# EAGLE design L3mk5ExRam (EAGLE 9.6.2)
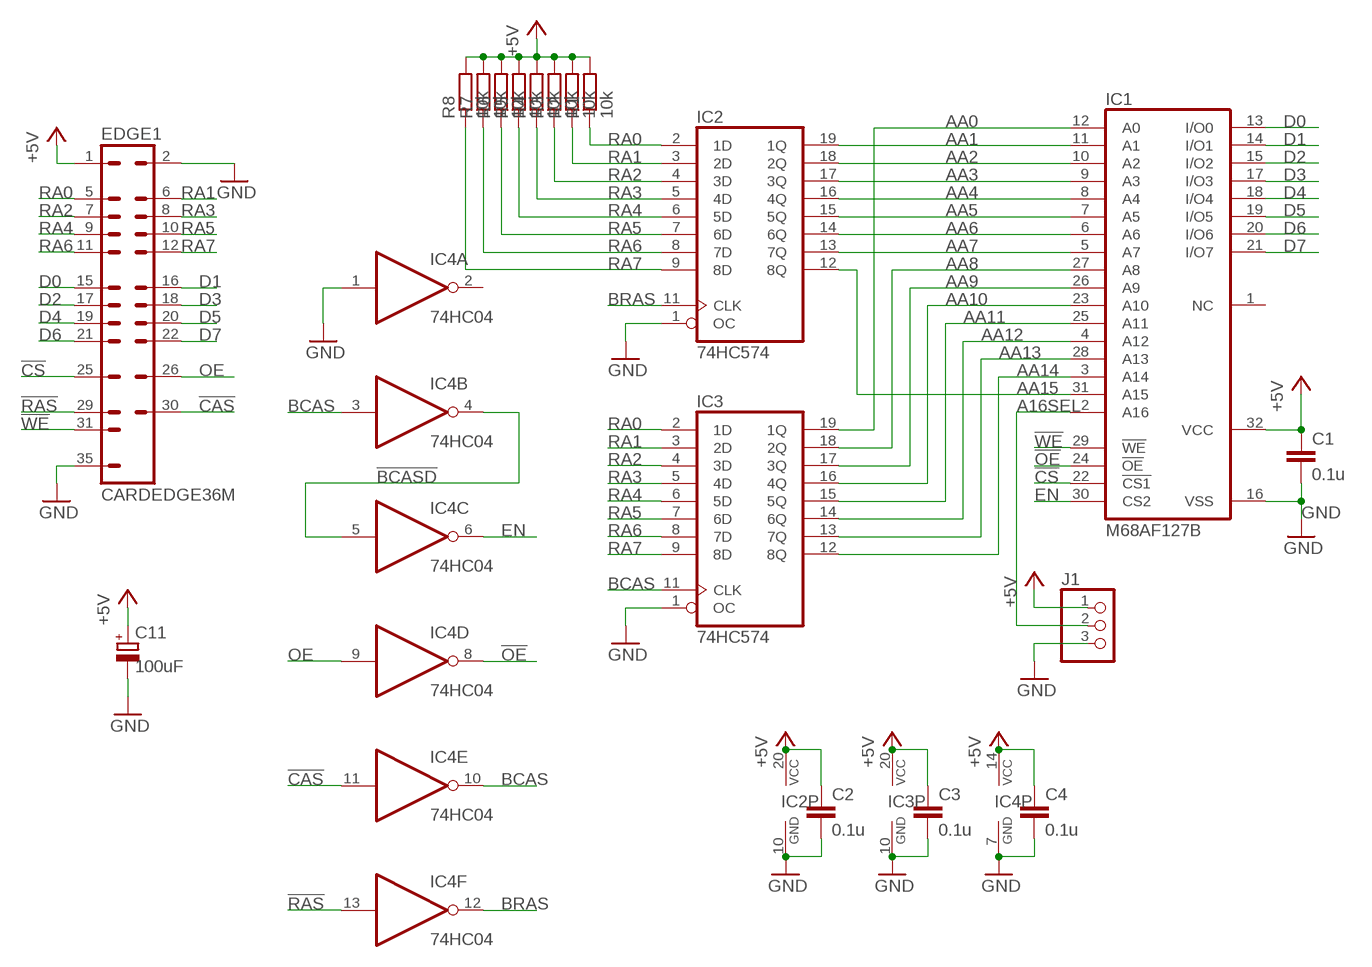
[diagram p0: schematic, sheet 1]

## Parts
C1  0.1u  C-EU025-024X044  [C025-024X044]
C2  0.1u  C-EU025-024X044  [C025-024X044]
C3  0.1u  C-EU025-024X044  [C025-024X044]
C4  0.1u  C-EU025-024X044  [C025-024X044]
C11  100uF  CPOL-EUE2-5  [E2-5]
EDGE1  CARDEDGE36M  [PM]
IC1  M68AF127B  [SOJ32-400]
IC2  74HC574  74HC574N  [DIL20]
IC3  74HC574  74HC574N  [DIL20]
IC4  74HC04  74HC04N  [DIL14]
J1  PINHD-1X3  [1X03]
R1  10k  R-EU_0204/2V  [0204V]
R2  10k  R-EU_0204/2V  [0204V]
R3  10k  R-EU_0204/2V  [0204V]
R4  10k  R-EU_0204/2V  [0204V]
R5  10k  R-EU_0204/2V  [0204V]
R6  10k  R-EU_0204/2V  [0204V]
R7  10k  R-EU_0204/2V  [0204V]
R8  10k  R-EU_0204/2V  [0204V]

## Nets
!BCASD: IC4.4(B:O) IC4.5(C:I)
!CAS: EDGE1.30 IC4.11(E:I)
!CS: EDGE1.25 IC1.22(!CS1)
!OE: IC1.24(!OE) IC4.8(D:O)
!RAS: EDGE1.29 IC4.13(F:I)
!WE: EDGE1.31 IC1.29(!WE)
+5V [Power]: C1.1 C2.1 C3.1 C4.1 C11.+ EDGE1.1 IC1.32(VCC) IC2.20(VCC) IC3.20(VCC) IC4.14(P:VCC) J1.1 R1.2 R2.2 R3.2 R4.2 R5.2 R6.2 R7.2 R8.2
A16SEL: IC1.2(A16) J1.2
AA0: IC1.12(A0) IC3.19(1Q)
AA1: IC1.11(A1) IC2.19(1Q)
AA2: IC1.10(A2) IC2.18(2Q)
AA3: IC1.9(A3) IC2.17(3Q)
AA4: IC1.8(A4) IC2.16(4Q)
AA5: IC1.7(A5) IC2.15(5Q)
AA6: IC1.6(A6) IC2.14(6Q)
AA7: IC1.5(A7) IC2.13(7Q)
AA8: IC1.27(A8) IC3.18(2Q)
AA9: IC1.26(A9) IC3.17(3Q)
AA10: IC1.23(A10) IC3.16(4Q)
AA11: IC1.25(A11) IC3.15(5Q)
AA12: IC1.4(A12) IC3.14(6Q)
AA13: IC1.28(A13) IC3.13(7Q)
AA14: IC1.3(A14) IC3.12(8Q)
AA15: IC1.31(A15) IC2.12(8Q)
BCAS: IC3.11(CLK) IC4.3(B:I) IC4.10(E:O)
BRAS: IC2.11(CLK) IC4.12(F:O)
D0: EDGE1.15 IC1.13(I/O0)
D1: EDGE1.16 IC1.14(I/O1)
D2: EDGE1.17 IC1.15(I/O2)
D3: EDGE1.18 IC1.17(I/O3)
D4: EDGE1.19 IC1.18(I/O4)
D5: EDGE1.20 IC1.19(I/O5)
D6: EDGE1.21 IC1.20(I/O6)
D7: EDGE1.22 IC1.21(I/O7)
EN: IC1.30(CS2) IC4.6(C:O)
GND [Power]: C1.2 C2.2 C3.2 C4.2 C11.- EDGE1.2 EDGE1.35 IC1.16(VSS) IC2.1(OC) IC2.10(GND) IC3.1(OC) IC3.10(GND) IC4.1(A:I) IC4.7(P:GND) J1.3
OE: EDGE1.26 IC4.9(D:I)
RA0 [Address]: EDGE1.5 IC2.2(1D) IC3.2(1D) R1.1
RA1 [Address]: EDGE1.6 IC2.3(2D) IC3.3(2D) R2.1
RA2 [Address]: EDGE1.7 IC2.4(3D) IC3.4(3D) R3.1
RA3 [Address]: EDGE1.8 IC2.5(4D) IC3.5(4D) R4.1
RA4 [Address]: EDGE1.9 IC2.6(5D) IC3.6(5D) R5.1
RA5 [Address]: EDGE1.10 IC2.7(6D) IC3.7(6D) R6.1
RA6 [Address]: EDGE1.11 IC2.8(7D) IC3.8(7D) R7.1
RA7 [Address]: EDGE1.12 IC2.9(8D) IC3.9(8D) R8.1
Unconnected: IC1.1(NC) IC4.2(A:O)

## Library data of the parts
C1-C4 = rcl:C-EU: CAPACITOR, European symbol; SPICEPREFIX: C
C11 = rcl:CPOL-EU: POLARIZED CAPACITOR, European symbol; SPICEPREFIX: C
EDGE1 = sasaji_parts:CARDEDGE36M
IC1 = sasaji_parts:M68AF127B
IC2 IC3 = 74xx-eu:74*574: 8-bit D type FLIP FLOP bus driver
IC4 = 74xx-eu:74*04: Hex INVERTER
J1 = pinhead:PINHD-1X3: PIN HEADER
R1-R8 = rcl:R-EU_: RESISTOR, European symbol; SPICEPREFIX: R

## Net classes
2 Power: width 0.508 mm

## Board
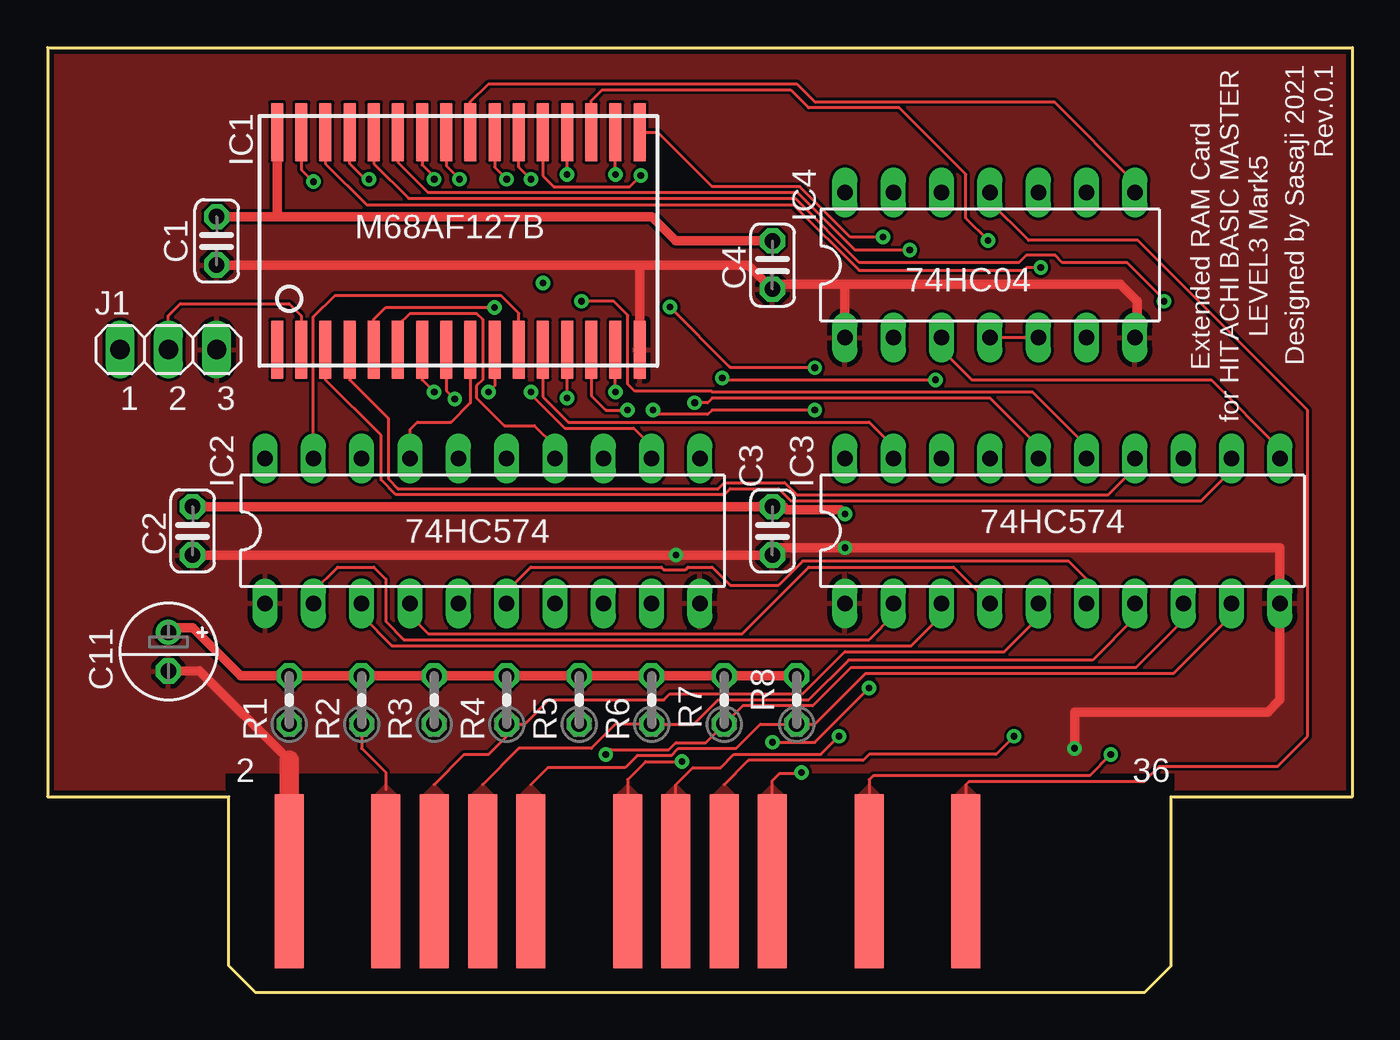
[diagram p1: board, top side]
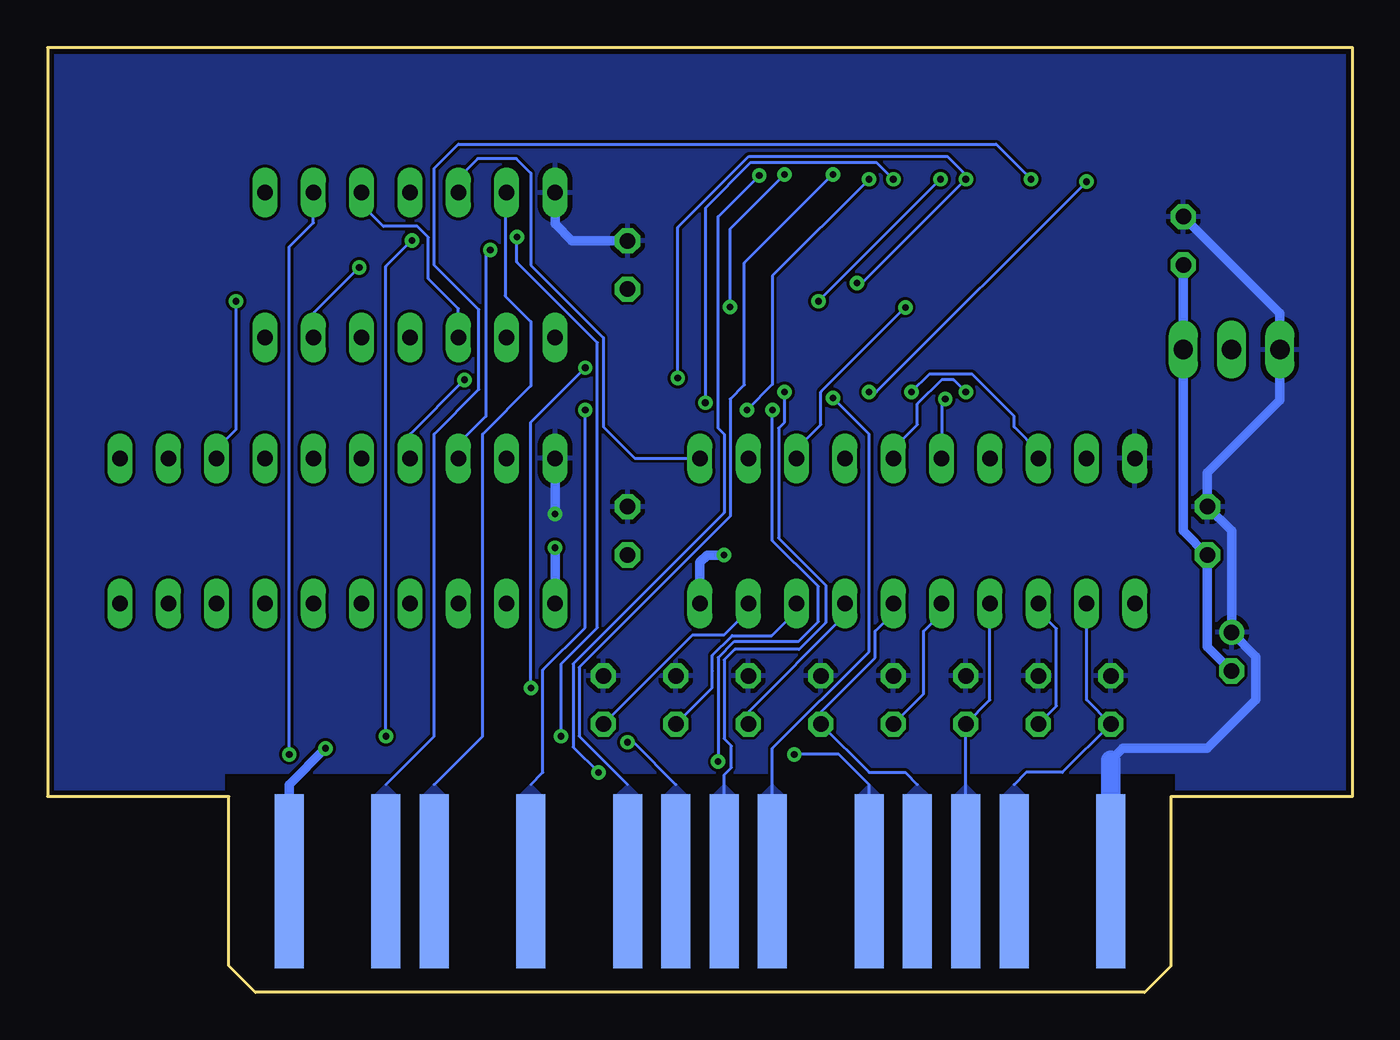
[diagram p2: board, bottom side, seen from below]

Size 68.58 x 49.66 mm. Coordinates in mm from the lower left corner, seen from the top.
Outline: 0,10.29 9.53,10.29 9.53,1.4 10.92,0 57.66,0 59.05,1.4 59.05,10.29 68.58,10.29 68.58,49.66 0,49.66 0,10.29
Copper layers (1*16): Top 0.035mm / dielectric 1.5mm / Bottom 0.035mm
Design rules "default *": minimum track width 6mil, minimum drill 0.35mm, track to track 6mil, track to pad 6mil, pad to pad 6mil, via to via 6mil, smd to smd 6mil, copper to edge 10mil, drill to drill 6mil, minimum pad ring 10mil, minimum via ring 8mil, stop-mask expansion 4mil, vias tented up to drill 0mil, thermal gap 10mil
vRestrict: area 8.9,-1.1 to 59.7,10.3

### Footprints (pad centres in the part's own frame; a part is rotated, then mirrored left to right if it is on the bottom)
C025-024X044 = drill 0.813 octagon: 1 -1.27,0; 2 1.27,0
E2-5 = drill 0.813 pad 1.27: + -1.016,0 | drill 0.813 pad 1.27 octagon: - 1.016,0
PM = smd 1.524 x 9.144 bottom: 1 -22.86,0; 5 -17.78,0; 7 -15.24,0; 9 -12.7,0; 11 -10.16,0; 15 -5.08,0; 17 -2.54,0; 19 0,0; 21 2.54,0; 25 7.62,0; 29 12.7,0; 31 15.24,0; 35 20.32,0 | smd 1.524 x 9.144: 2 -22.86,0; 6 -17.78,0; 8 -15.24,0; 10 -12.7,0; 12 -10.16,0; 16 -5.08,0; 18 -2.54,0; 20 0,0; 22 2.54,0; 26 7.62,0; 30 12.7,0
SOJ32-400 = smd 0.635 x 3.048: 1 -9.525,-5.715; 2 -8.255,-5.715; 3 -6.985,-5.715; 4 -5.715,-5.715; 5 -4.445,-5.715; 6 -3.175,-5.715; 7 -1.905,-5.715; 8 -0.635,-5.715; 9 0.635,-5.715; 10 1.905,-5.715; 11 3.175,-5.715; 12 4.445,-5.715; 13 5.715,-5.715; 14 6.985,-5.715; 15 8.255,-5.715; 16 9.525,-5.715; 17 9.525,5.715; 18 8.255,5.715; 19 6.985,5.715; 20 5.715,5.715; 21 4.445,5.715; 22 3.175,5.715; 23 1.905,5.715; 24 0.635,5.715; 25 -0.635,5.715; 26 -1.905,5.715; 27 -3.175,5.715; 28 -4.445,5.715; 29 -5.715,5.715; 30 -6.985,5.715; 31 -8.255,5.715; 32 -9.525,5.715
DIL20 = drill 0.813 long: 1 -11.43,-3.81; 2 -8.89,-3.81; 3 -6.35,-3.81; 4 -3.81,-3.81; 5 -1.27,-3.81; 6 1.27,-3.81; 7 3.81,-3.81; 8 6.35,-3.81; 9 8.89,-3.81; 10 11.43,-3.81; 11 11.43,3.81; 12 8.89,3.81; 13 6.35,3.81; 14 3.81,3.81; 15 1.27,3.81; 16 -1.27,3.81; 17 -3.81,3.81; 18 -6.35,3.81; 19 -8.89,3.81; 20 -11.43,3.81
DIL14 = drill 0.813 long: 1 -7.62,-3.81; 2 -5.08,-3.81; 3 -2.54,-3.81; 4 0,-3.81; 5 2.54,-3.81; 6 5.08,-3.81; 7 7.62,-3.81; 8 7.62,3.81; 9 5.08,3.81; 10 2.54,3.81; 11 0,3.81; 12 -2.54,3.81; 13 -5.08,3.81; 14 -7.62,3.81
1X03 = drill 1.016 long: 1 -2.54,0; 2 0,0; 3 2.54,0
0204V = drill 0.813 octagon: 1 -1.27,0; 2 1.27,0

### Placement (x,y rotation side)
C1  8.89,39.5 270 top
C2  7.62,24.26 270 top
C3  38.1,24.26 270 top
C4  38.1,38.23 270 top
C11  6.35,17.91 270 top
EDGE1  35.56,5.84 0 top
IC1  21.59,39.5 0 top
IC2  22.86,24.26 0 top
IC3  53.34,24.26 0 top
IC4  49.53,38.23 0 top
J1  6.35,33.78 0 top
R1  12.7,15.37 90 top
R2  16.51,15.37 90 top
R3  20.32,15.37 90 top
R4  24.13,15.37 90 top
R5  27.94,15.37 90 top
R6  31.75,15.37 90 top
R7  35.56,15.37 90 top
R8  39.37,15.37 90 top

### Tracks (layer width: path | path; a pad name or v marks a point on that pad's centre or on a via)
!BCASD
  Top 0.152: IC4.5 IC4.4
!CAS
  Top 0.152: 48.26,10.29 48.26,10.92 48.43,11.09 57.64,11.09 58.42,11.87 64.64,11.87 66.23,13.46 66.23,30.59 57.3,39.52 51.56,39.52 49.53,41.55 IC4.11
  pour Top: 47.62,10.29 48.26,10.92 48.9,10.29
!CS  (via drill 0.35)
  Top 0.152: v40.32,30.61 34.92,30.61 34.7,30.38 32.05,30.38 v31.83,30.61 | IC1.22 24.77,43.37 v25.4,42.74
  Bottom 0.152: v40.32,30.61 40.32,19.18 42.55,16.95 42.55,11.56 43.18,10.92 | v25.4,42.74 30.48,37.66 30.48,31.95 v31.83,30.61
  pour Bottom: 42.55,10.29 43.18,10.92 43.81,10.29
!OE
  Top 0.152: IC4.8 57.15,42.55 52.9,46.8 40.32,46.8 39.37,47.75 23.18,47.75 22.23,46.8 IC1.24
!RAS
  Bottom 0.152: 48.26,10.92 45.72,13.46 45.72,29.34 43.18,31.88 43.18,35.26 44.54,36.61 44.52,36.63 44.52,41.96 IC4.13
  pour Bottom: 47.62,10.29 48.26,10.92 48.9,10.29
!WE  (via drill 0.35)
  Top 0.152: IC1.29 15.88,43.56 16.7,42.74 v16.89,42.74
  Bottom 0.152: v16.89,42.74 18.73,44.58 46.99,44.58 48.26,43.31 48.26,38.23 45.91,35.88 45.91,31.69 48.26,29.34 48.26,13.46 50.8,10.92
  pour Bottom: 50.16,10.29 50.8,10.92 51.44,10.29
+5V  (via drill 0.35)
  Top 0.508: R5.2 R1.2 10.16,16.64 7.62,19.18 6.62,19.18 C11.+ | R5.2 R7.2 | R7.2 R8.2 | C2.1 C3.1 38.69,25.53 38.85,25.36 41.69,25.36 v41.91,25.15 | C1.1 12.06,40.77 | 12.06,40.77 IC1.32 | R4.2 R5.2 | R6.2 R7.2 | C4.1 33.02,39.5 31.75,40.77 12.06,40.77
  Bottom 0.508: IC3.20 v41.91,25.15 | 12.7,12.19 12.06,12.83 7.62,12.83 5.08,15.37 5.08,17.64 C11.+ 6.35,24.26 C2.1 7.62,27.3 3.81,31.11 J1.1 3.81,35.69 C1.1 | C4.1 41.02,39.5 41.91,40.39 IC4.14
  Bottom 1.016: EDGE1.1 12.7,12.19
  pour Bottom: -1.27,50.93 69.85,50.93 69.85,9.02 59.31,9.02 59.31,11.56 9.27,11.56 9.27,8.38 -1.27,8.38
A16SEL
  Top 0.152: J1.2 6.35,35.56 6.99,36.2 12.7,36.2 13.34,35.56 IC1.2
AA0
  Top 0.152: IC3.19 44.45,28.7 43.18,29.97 27.37,29.97 26.04,31.3 IC1.12
AA1
  Top 0.152: IC1.11 24.77,35.69 23.81,36.64 15.11,36.64 13.97,35.5 IC2.19
AA2  (via drill 0.35)
  Top 0.152: v23.18,31.56 23.5,31.88 IC1.10
  Bottom 0.152: v23.18,31.56 22.23,32.51 20,32.51 17.78,30.29 17.78,29.72 16.51,28.45 IC2.18
AA3
  Top 0.152: IC1.9 22.23,30.99 21.21,29.97 19.43,29.97 19.05,29.59 IC2.17
AA4  (via drill 0.35)
  Top 0.152: v21.4,31.18 20.95,31.62 IC1.8
  Bottom 0.152: IC2.16 21.59,30.99 v21.4,31.18
AA5  (via drill 0.35)
  Top 0.152: v20.32,31.56 19.68,32.19 IC1.7
  Bottom 0.152: v20.32,31.56 20.95,32.19 21.59,32.19 22.86,30.92 22.86,29.84 24.13,28.57 IC2.15
AA6
  Top 0.152: IC2.14 26.67,28.7 25.59,29.78 24,29.78 22.54,31.24 22.54,31.88 22.86,32.19 22.86,35.37 22.54,35.69 19.05,35.69 18.41,35.05 IC1.6
AA7  (via drill 0.35)
  Top 0.152: v23.5,36.01 17.78,36.01 17.14,35.37 IC1.5
  Bottom 0.152: v23.5,36.01 27.94,31.56 27.94,29.84 29.21,28.57 IC2.13
AA8  (via drill 0.35)
  Top 0.152: IC1.27 18.41,43.62 20,42.04 39.42,42.04 42.44,39.01 v45.31,39.01
  Bottom 0.152: IC3.18 46.99,28.83 45.54,30.28 45.54,38.79 v45.31,39.01
AA9  (via drill 0.35)
  Top 0.152: v46.67,32.19 35.56,32.19 35.53,32.21 v35.46,32.28 | v20.32,42.74 20.32,42.86 19.68,43.5 IC1.26
  Bottom 0.152: v46.67,32.19 49.53,29.34 IC3.17 | v26.04,37.27 25.78,37.27 v20.32,42.74 20.32,42.98 21.29,43.94 31.73,43.94 35.46,40.21 v35.46,32.28
AA10  (via drill 0.35)
  Top 0.152: IC3.16 52.07,28.7 49.53,31.24 34.92,31.24 34.92,31.22 34.7,30.99 v34.01,30.99 | v24.13,42.74 23.5,43.37 IC1.23
  Bottom 0.152: v34.01,30.99 34.01,41.23 31.61,43.62 25.02,43.62 v24.13,42.74
AA11  (via drill 0.35)
  Top 0.152: IC3.15 54.61,28.7 51.75,31.56 34.92,31.56 34.9,31.6 30.86,31.6 30.5,31.95 30.5,35.59 29.77,36.32 v28.07,36.32 | v21.65,42.74 20.95,43.43 IC1.25
  Bottom 0.152: v28.07,36.32 v21.65,42.74
AA12
  Top 0.152: IC3.14 57.15,27.56 55.75,26.16 39.37,26.16 38.73,26.8 35.56,26.8 35.24,26.48 18.41,26.48 17.91,26.99 17.91,30.16 15.88,32.19 IC1.4
AA13  (via drill 0.35)
  Top 0.152: IC1.28 17.14,43.56 18.97,41.73 39.29,41.73 42.67,38.35 51.05,38.35 51.44,38.73 52.96,38.73 53.34,38.35 56.74,38.35 58.67,36.42 v58.67,36.32
  Bottom 0.152: v58.67,36.32 58.67,29.59 59.69,28.57 IC3.13
AA14
  Top 0.152: IC3.12 62.23,27.43 60.64,25.84 39.05,25.84 38.42,26.48 35.88,26.48 35.56,26.16 18.3,26.16 17.53,26.94 17.53,29.27 14.61,32.19 IC1.3
AA15  (via drill 0.35)
  Top 0.152: IC2.12 31.75,28.7 30.8,29.65 27.18,29.65 25.4,31.43 v25.4,31.56 | v13.97,42.61 13.34,43.24 IC1.31
  Bottom 0.152: v25.4,31.56 25.02,31.56 v13.97,42.61
BCAS
  Top 0.152: IC3.11 64.77,28.57 61.15,32.19 48.58,32.19 46.99,33.78 IC4.3
  Bottom 0.152: IC4.10 52.07,41.4 50.93,40.26 49.15,40.26 48.56,39.67 48.56,37.52 46.99,35.94 IC4.3
BRAS
  Bottom 0.152: IC4.12 46.99,42.8 45.97,43.81 43.94,43.81 43.18,43.05 43.18,38.23 39.37,34.42 39.37,29.72 37.72,28.07 IC2.11
D0  (via drill 0.35)
  Top 0.152: v27.3,31.24 IC1.13
  Bottom 0.152: v27.3,31.24 25.4,29.34 25.4,17.91 30.48,12.83 EDGE1.15
  pour Bottom: 29.84,10.29 30.48,10.92 31.11,10.29
D1  (via drill 0.35)
  Top 0.152: IC1.14 28.57,31.37 29.34,30.61 v30.48,30.61 | v33.34,12.13 31.43,12.13 30.48,11.18 EDGE1.16
  Bottom 0.152: v33.34,12.13 33.34,17.59 32.48,18.45 29.1,18.45 28.07,19.48 28.07,21.34 30.48,23.75 v30.48,30.61
  pour Top: 29.84,10.29 30.48,10.92 31.11,10.29
D2  (via drill 0.35)
  Top 0.152: v29.84,31.56 IC1.15
  Bottom 0.152: v29.84,31.56 29.84,29.97 30.16,29.65 30.16,23.88 27.69,21.4 27.69,19.43 29.08,18.03 32.46,18.03 33.02,17.48 33.02,13.34 32.64,12.95 32.64,11.81 33.02,11.43 EDGE1.17
  pour Bottom: 32.38,10.29 33.02,10.92 33.66,10.29
D3  (via drill 0.35)
  Top 0.152: v41.59,13.46 40.64,12.51 36.07,12.51 35.37,11.81 33.91,11.81 33.02,10.92 EDGE1.18 | IC1.17 32.07,45.21 34.92,42.35 39.53,42.35 42.19,39.7 v43.92,39.7
  Bottom 0.152: v41.59,13.46 41.59,17.27 39.69,19.18 39.69,34.15 43.92,38.38 v43.92,39.7
  pour Top: 32.38,10.29 33.02,10.92 33.66,10.29
D4  (via drill 0.35)
  Top 0.152: v29.84,42.99 IC1.18 | v40.32,32.83 35.88,32.83 35.84,32.89 v32.72,36.02 | v43.18,16 40.32,13.14 v38.1,13.14
  Bottom 0.152: v40.32,32.83 43.18,29.97 v43.18,16 | 35.56,10.92 37.78,13.14 v38.1,13.14 | v32.72,36.02 32.72,40.12 v29.84,42.99
  pour Bottom: 34.92,10.29 35.56,10.92 36.2,10.29
D5  (via drill 0.35)
  Top 0.152: IC1.19 28.57,46.86 29.15,47.43 39.05,47.43 40.01,46.48 44.77,46.48 48.26,42.99 48.26,40.69 v49.43,39.52 | v50.8,13.46 49.85,12.51 43.18,12.51 42.86,12.19 36.83,12.19 35.56,10.92
  Bottom 0.152: v49.43,39.52 50.8,38.15 v50.8,13.46
  pour Top: 34.92,10.29 35.56,10.92 36.2,10.29
D6  (via drill 0.35)
  Top 0.152: v27.3,42.99 IC1.20
  Bottom 0.152: 38.1,10.92 40.64,13.46 40.64,17.08 32.7,25.02 32.7,31.18 31.95,31.93 31.95,38.34 v27.3,42.99
  pour Bottom: 37.47,10.29 38.1,10.92 38.73,10.29
D7  (via drill 0.35)
  Top 0.152: IC1.21 26.04,42.93 26.61,42.35 30.61,42.35 v31.18,42.93 | v39.62,11.56 39.57,11.51 38.48,11.51 38.1,11.12 38.1,10.29
  Bottom 0.152: v31.18,42.93 33.34,40.77 33.34,29.65 33.02,29.34 33.02,25.21 40.96,17.27 40.96,12.89 v39.62,11.56
  pour Top: 37.47,10.29 38.1,10.92 38.73,10.29
EN  (via drill 0.35)
  Top 0.152: IC1.30 14.61,43.56 16.76,41.4 39.19,41.4 42.65,37.95 51.31,37.95 51.46,38.1 v52.2,38.1
  Bottom 0.152: v52.2,38.1 54.61,35.69 IC4.6
GND  (via drill 0.35)
  Top 0.508: C2.2 v33.02,22.99 C3.2 38.48,23.37 v41.91,23.37 64.77,23.37 IC3.10 64.77,15.37 64.14,14.73 53.98,14.73 v53.98,12.83 | C1.2 13.21,38.23 31.11,38.23 | 31.11,38.23 36.83,38.23 C4.2 38.35,37.21 41.91,37.21 | 12.7,12.19 7.99,16.91 C11.- | IC4.7 57.28,34.54 57.28,36.32 56.39,37.21 41.91,37.21 | IC4.1 41.91,37.21 | IC1.16 31.11,38.23
  Top 1.016: EDGE1.2 12.7,12.19
  Bottom 0.508: C11.- 7.62,18.18 C2.2 8.89,24.26 J1.3 C1.2 | IC2.10 34.29,22.61 33.91,22.99 v33.02,22.99 | 41.91,23.5 v41.91,23.37 IC3.1 | v53.98,12.83 55.88,10.92 EDGE1.35
  pour Top: -1.27,50.93 69.85,50.93 69.85,9.02 59.31,9.02 59.31,11.56 9.27,11.56 9.27,9.02 -1.27,9.02
OE  (via drill 0.35)
  Top 0.152: v55.88,12.51 54.77,11.4 43.4,11.4 43.18,11.18 43.18,10.29 43.69,10.29
  Bottom 0.152: v55.88,12.51 55.88,39.18 54.61,40.45 IC4.9
  pour Top: 42.55,10.29 43.18,10.92 43.81,10.29
RA0
  Top 0.152: IC3.2 44.45,19.81 43.18,18.54 18.73,18.54 17.78,19.49 17.78,21.72 17.14,22.35 15.24,22.35 13.97,21.08 IC2.2
  Bottom 0.152: IC2.2 13.97,15.37 R1.1 15.24,11.56 17.14,11.56 17.78,10.92
  pour Bottom: 17.14,10.29 17.78,10.92 18.41,10.29
RA1
  Top 0.152: R2.1 16.51,12.83 17.78,11.56 17.78,10.67 | IC3.3 46.99,19.81 45.4,18.22 18.1,18.22 16.51,19.81 IC2.3
  Bottom 0.152: IC2.3 16.51,20.07 15.56,19.11 15.56,15.05 R2.1
  pour Top: 17.14,10.29 17.78,10.92 18.41,10.29
RA2
  Top 0.152: IC3.4 47.62,22.35 40.01,22.35 36.51,18.86 20,18.86 19.05,19.81 IC2.4
  Bottom 0.152: IC2.4 19.05,15.37 R3.1 EDGE1.7
  pour Bottom: 19.68,10.29 20.32,10.92 20.95,10.29
RA3
  Top 0.152: 24.77,14.1 25.08,14.1 26.35,15.37 32.38,15.37 32.7,15.68 39.69,15.68 41.91,17.91 50.29,17.91 52.07,19.68 IC3.5 | 24.77,14.1 23.18,12.51 21.91,12.51 20.32,10.92 | 24.77,14.1 R4.1
  Bottom 0.152: IC2.5 21.59,19.94 22.54,18.99 22.54,15.68 R4.1
  pour Top: 19.68,10.29 20.32,10.92 20.95,10.29
RA4
  Top 0.152: IC3.6 54.61,21.72 53.66,22.67 39.69,22.67 38.42,21.4 35.88,21.4 34.92,22.35 33.66,22.35 33.53,22.23 32.38,22.23 32.26,22.35 25.4,22.35 24.13,21.08 IC2.6
  Bottom 0.152: IC2.6 24.13,19.94 25.08,18.99 25.08,17.59 27.94,14.73 R5.1 25.4,11.56 23.5,11.56 22.86,10.92
  pour Bottom: 22.23,10.29 22.86,10.92 23.5,10.29
RA5
  Top 0.152: IC3.7 57.15,19.68 54.93,17.46 42.1,17.46 40.01,15.37 35.24,15.37 33.97,14.1 R6.1 29.84,14.1 28.57,12.83 24.77,12.83 22.86,10.92
  Bottom 0.152: IC2.7 26.67,19.81 31.75,14.73 R6.1
  pour Top: 22.23,10.29 22.86,10.92 23.5,10.29
RA6  (via drill 0.35)
  Top 0.152: v29.34,12.51 29.59,12.76 32.65,12.76 33.02,13.13 34.59,13.13 R7.1 36.52,15.06 40.21,15.06 42.22,17.07 57.2,17.07 59.69,19.56 IC3.8
  Bottom 0.152: v29.34,12.51 26.99,12.51 25.4,10.92 EDGE1.11 | R7.1 33.66,16 33.66,16.89 33.64,16.9 33.64,17.72 32.61,18.75 30.52,18.75 29.21,20.07 IC2.8
  pour Bottom: 24.77,10.29 25.4,10.92 26.04,10.29
RA7
  Top 0.152: IC3.9 62.23,19.81 59.18,16.76 42.99,16.76 40.32,14.1 R8.1 37.47,14.1 36.2,12.83 33.15,12.83 32.77,12.45 30.99,12.45 30.35,11.81 26.29,11.81 25.4,10.92
  Bottom 0.152: R8.1 34.67,18.8 33.02,18.8 31.75,20.07 IC2.9
  pour Top: 24.77,10.29 25.4,10.92 26.04,10.29

### Text on the board
tPlace: Designed by Sasaji 2021 / Rev.0.1 | Extended RAM Card / for HITACHI BASIC MASTER / LEVEL3 Mark5